# EAGLE design cascadio (EAGLE 9.5.0)

## Sheet 1 of 3
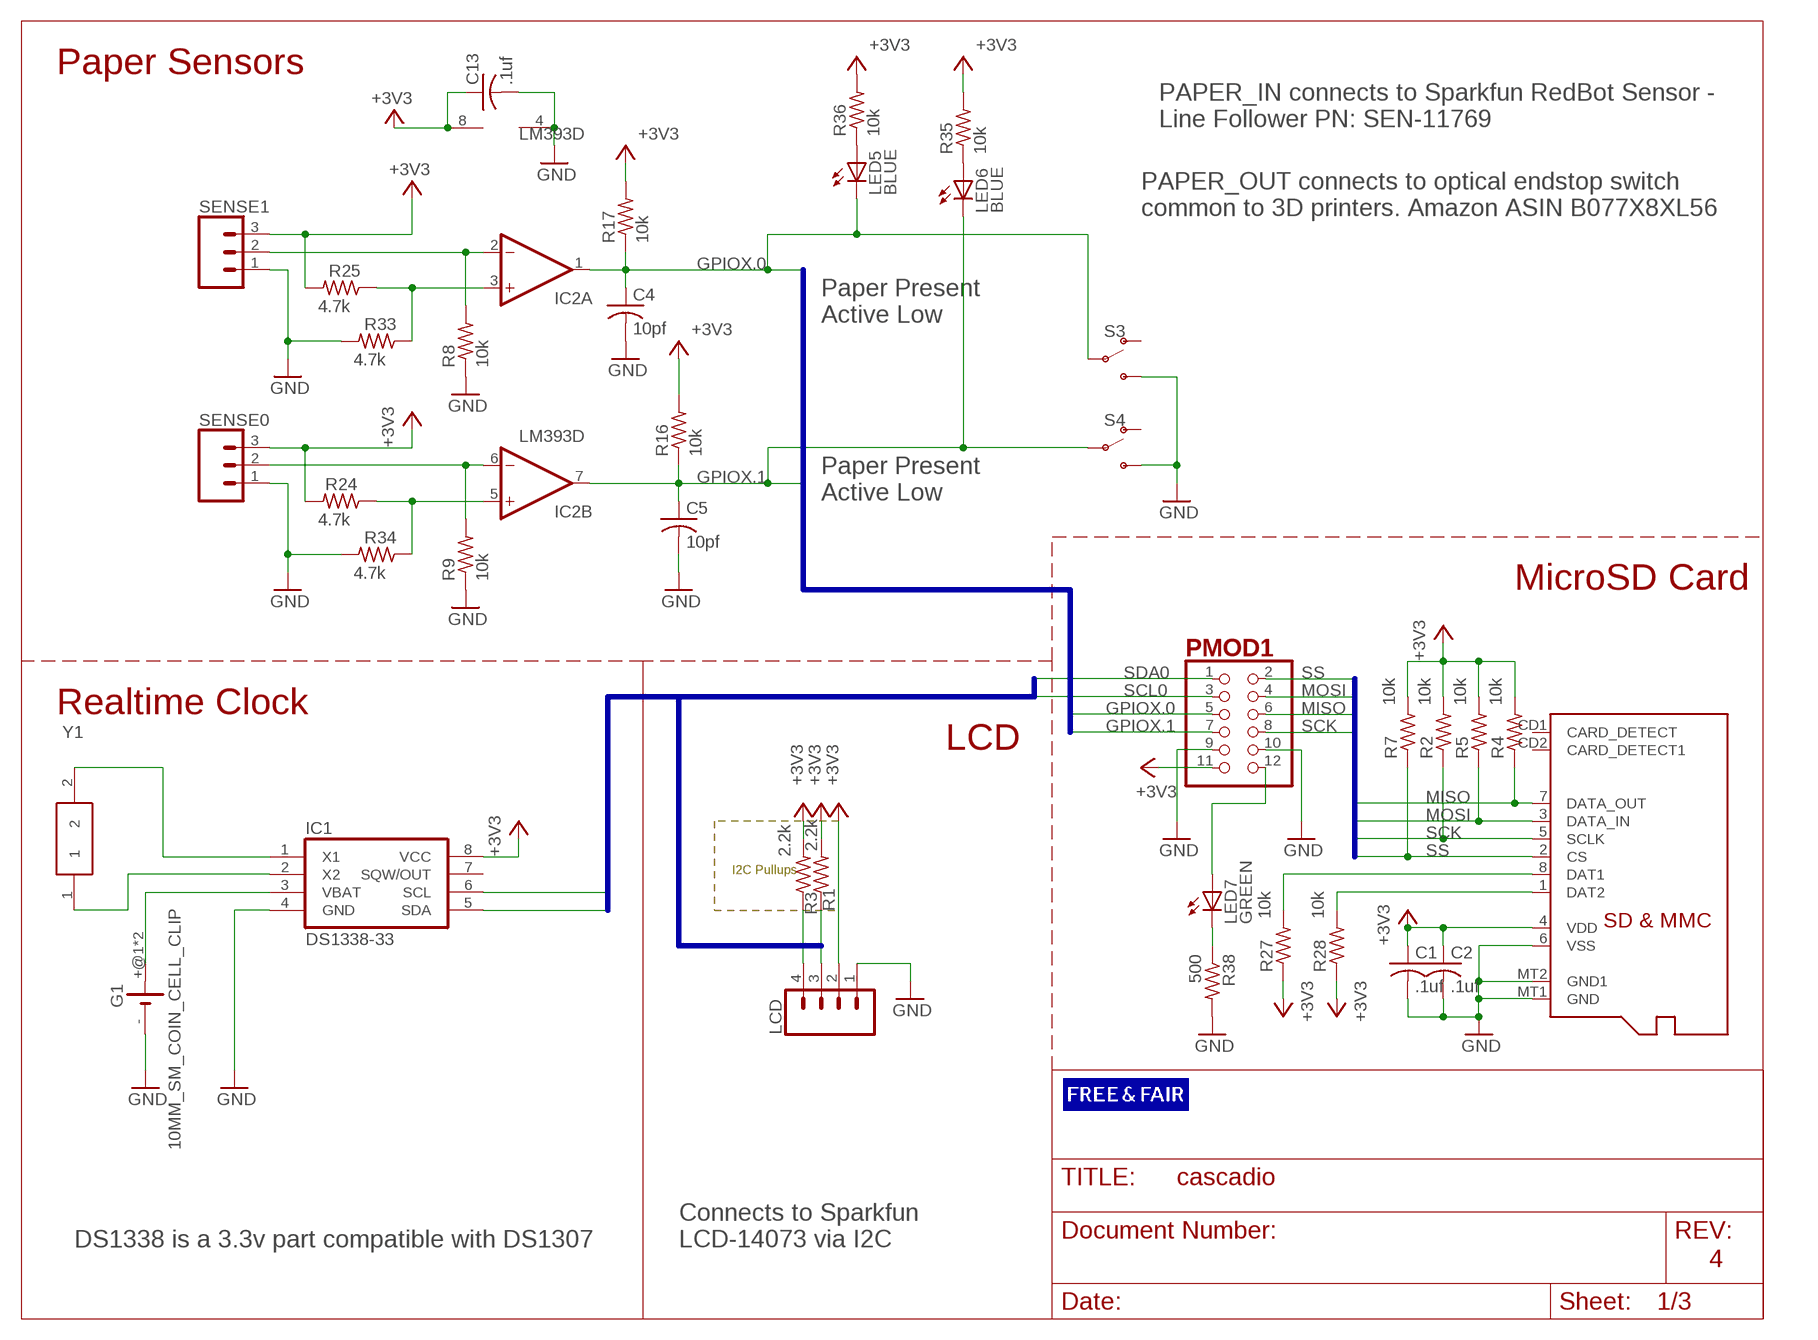
[diagram p0: schematic, sheet 1]

### Parts
C1  .1uf  C-USC0603K  [C0603K]
C2  .1uf  C-USC0603K  [C0603K]
C4  10pf  C-USC0603K  [C0603K]
C5  10pf  C-USC0603K  [C0603K]
C13  .1uf  C-USC0603K  [C0603K]
G1  10MM_SM_COIN_CELL_CLIP  [10MM_SM_COIN_CELL_CLIP]
IC1  DS1338-33  IC_RTC_DS1307  [SO-8]
IC2  LM393D  [SO08]
LCD  CONN_04POLAR_LOCK  [MOLEX-1X4_LOCK]
LED5  BLUE  LEDCHIP-LED0603  [CHIP-LED0603]
LED6  BLUE  LEDCHIP-LED0603  [CHIP-LED0603]
LED7  GREEN  LEDCHIP-LED0603  [CHIP-LED0603]
PMOD1  PINHD-2X6  [2X06]
R1  2.2k  R-US_R0603  [R0603]
R2  10k  R-US_R0603  [R0603]
R3  2.2k  R-US_R0603  [R0603]
R4  10k  R-US_R0603  [R0603]
R5  10k  R-US_R0603  [R0603]
R7  10k  R-US_R0603  [R0603]
R8  10k  R-US_R0603  [R0603]
R9  10k  R-US_R0603  [R0603]
R16  10k  R-US_R0603  [R0603]
R17  10k  R-US_R0603  [R0603]
R24  4.7k  R-US_R0603  [R0603]
R25  4.7k  R-US_R0603  [R0603]
R27  10k  R-US_R0603  [R0603]
R28  10k  R-US_R0603  [R0603]
R33  4.7k  R-US_R0603  [R0603]
R34  4.7k  R-US_R0603  [R0603]
R35  10k  R-US_R0603  [R0603]
R36  10k  R-US_R0603  [R0603]
R38  500  R-US_R0603  [R0603]
S3  SPDT_TOGGLE_BUTTONMICRO  [BTN-PUSH-PUSH-PS-2214-L]
S4  SPDT_TOGGLE_BUTTONMICRO  [BTN-PUSH-PUSH-PS-2214-L]
SENSE0  SENSE0  CONN_03POLAR_LOCK  [MOLEX-1X3_LOCK]
SENSE1  CONN_03POLAR_LOCK  [MOLEX-1X3_LOCK]
U1  MICROSD  [MICROSD]
Y1  32.768khz  ABS07W-32.768KHZ-D-1-T  [ABS07AIG32768KHZ71T]

### Nets
+3V3: C1.1 C2.1 C13.1 IC1.8(VCC) IC2.8(P:V+) LCD.2 PMOD1.11 R1.2 R2.2 R3.2 R4.2 R5.2 R7.2 R16.2 R17.2 R24.2 R25.2 R27.1 R28.1 R35.2 R36.2 SENSE0.3 SENSE1.3 U1.4(VDD) ; also sheet 2,3
GND: C1.2 C2.2 C4.2 C5.2 C13.2 G1.- IC1.4(GND) IC2.4(P:V-) LCD.1 PMOD1.9 PMOD1.10 R8.1 R9.1 R33.2 R34.2 R38.2 S3.NO0(S) S3.NO1(S) S4.NO0(S) S4.NO1(S) SENSE0.1 SENSE1.1 U1.6(VSS) U1.MT1(GND) U1.MT2(GND1) ; also sheet 2,3
GPIOX.0: C4.1 IC2.1(A:OUT) LED5.C PMOD1.5 R17.1 S3.C0(P) S3.C1(P) ; also sheet 3
GPIOX.1: C5.1 IC2.7(B:OUT) LED6.C PMOD1.7 R16.1 S4.C0(P) S4.C1(P) ; also sheet 3
MISO: PMOD1.6 R4.1 U1.7(DATA_OUT) ; also sheet 3
MOSI: PMOD1.4 R5.1 U1.3(DATA_IN) ; also sheet 3
N$1: IC2.5(B:+IN) R24.1 R34.1
N$2: IC2.3(A:+IN) R25.1 R33.1
N$3: IC1.1(X1) Y1.2
N$6: R27.2 U1.8(DAT1)
N$7: R28.2 U1.1(DAT2)
N$8: IC1.2(X2) Y1.1
N$9: G1.+@1(+) G1.+@2(+) IC1.3(VBAT)
N$13: IC2.2(A:-IN) R8.2 SENSE1.2
N$15: IC2.6(B:-IN) R9.2 SENSE0.2
N$18: LED6.A R35.1
N$19: LED5.A R36.1
N$22: LED7.C R38.1
N$23: LED7.A PMOD1.12
SCK: PMOD1.8 R2.1 U1.5(SCLK) ; also sheet 3
SCL0: IC1.6(SCL) LCD.4 PMOD1.3 R3.1 ; also sheet 3
SDA0: IC1.5(SDA) LCD.3 PMOD1.1 R1.1 ; also sheet 3
SS: PMOD1.2 R7.1 U1.2(CS) ; also sheet 3
Unconnected: IC1.7(SQW/OUT) S3.NC0(O) S3.NC1(O) S4.NC0(O) S4.NC1(O) U1.CD1(CARD_DETECT) U1.CD2(CARD_DETECT1)

### Buses
MISO,MOSI,SCK,SS
I2C:SCL0,SDA0
GPIOX.0,GPIOX.1

### Notes on the sheet
- Paper Sensors
- PAPER_IN connects to Sparkfun RedBot Sensor - 
  Line Follower PN: SEN-11769
- PAPER_OUT connects to optical endstop switch 
  common to 3D printers. Amazon ASIN B077X8XL56
- Paper Present
  Active Low
- Paper Present
  Active Low
- MicroSD Card
- Realtime Clock
- LCD
- I2C Pullups
- DS1338 is a 3.3v part compatible with DS1307
- Connects to Sparkfun
  LCD-14073 via I2C
- 4

## Sheet 2 of 3
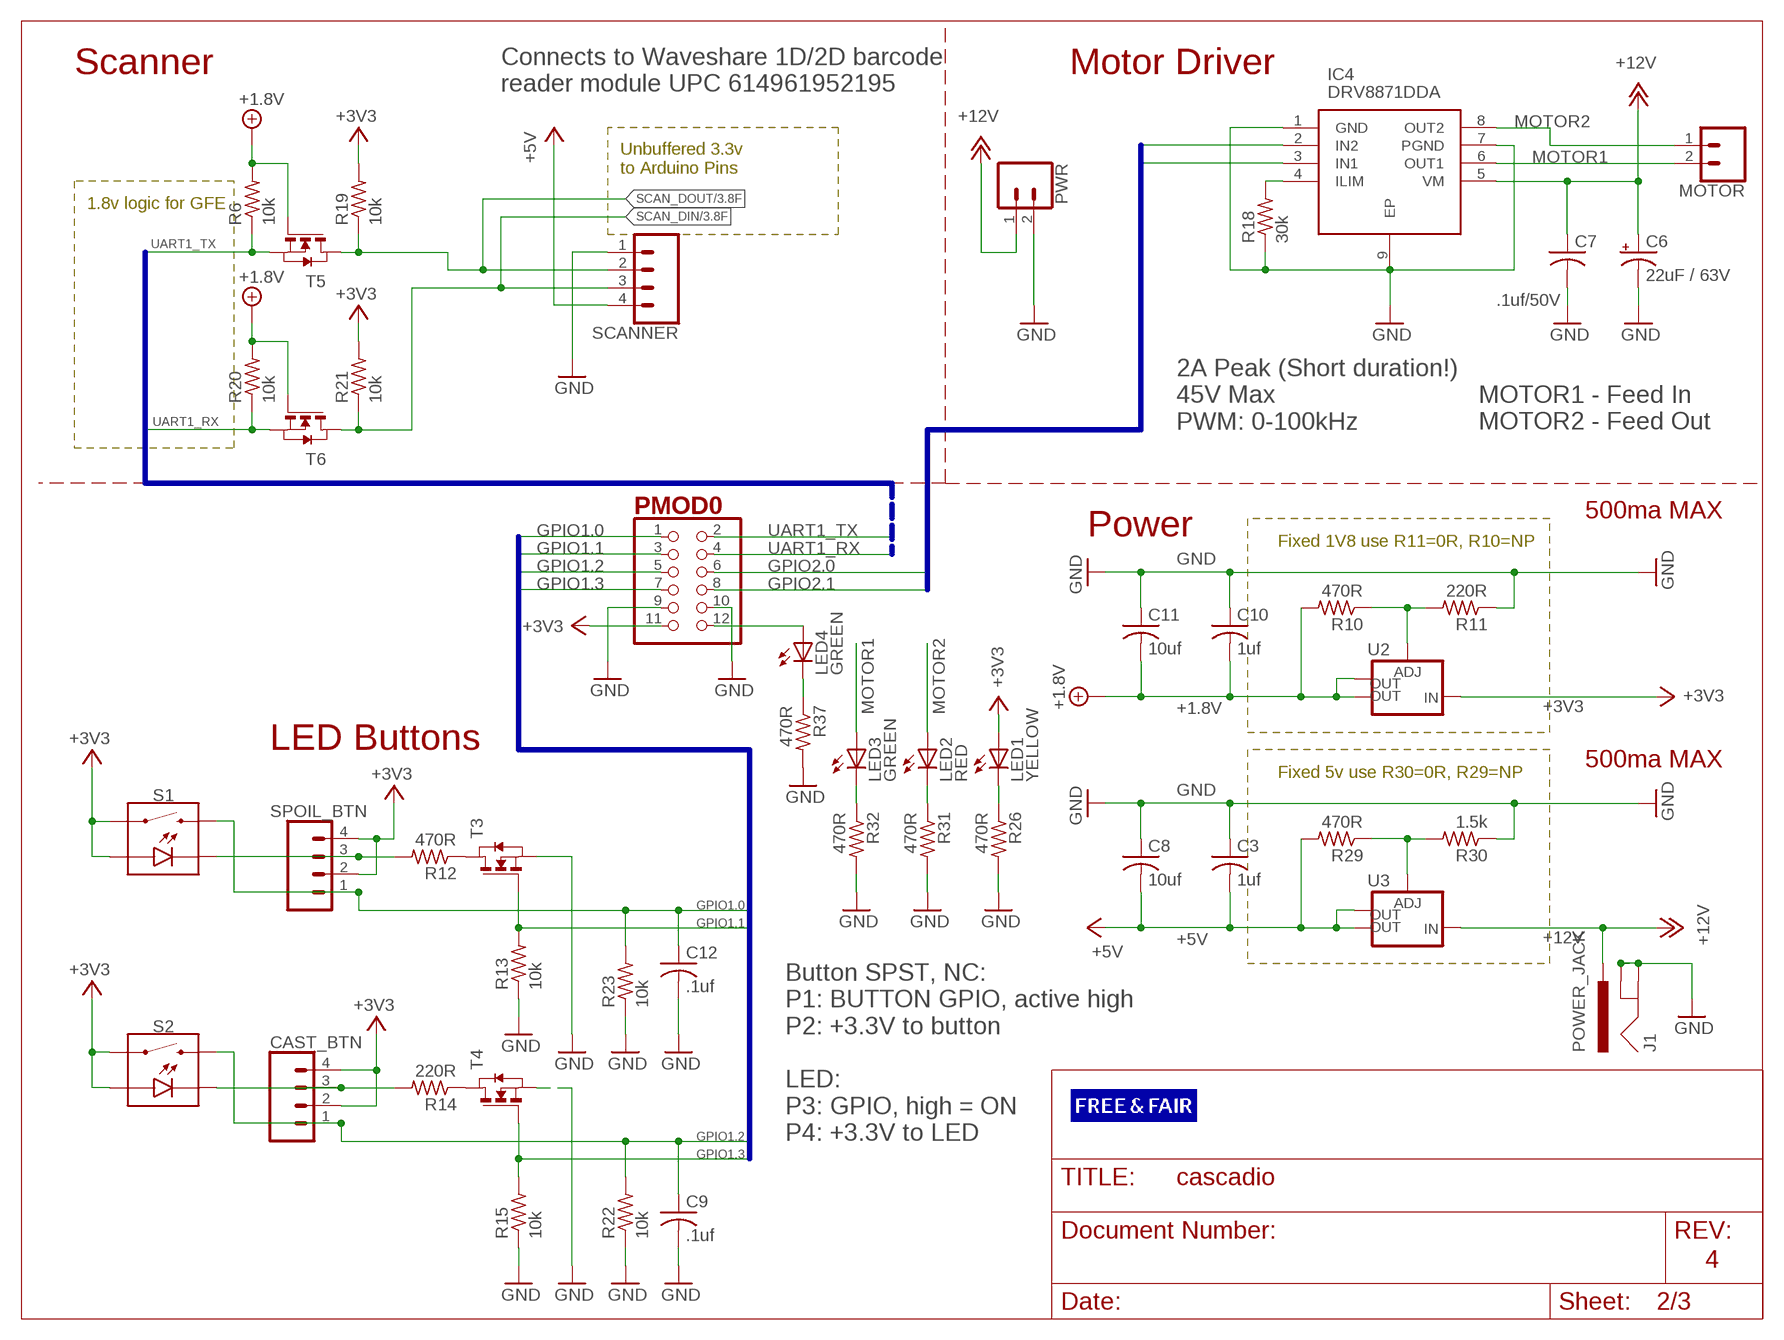
[diagram p1: schematic, sheet 2]

### Parts
C3  1uf  C-USC0603K  [C0603K]
C6  22uF / 63V  CPOL-USD  [PANASONIC_D]
C7  .1uf/50V  C-USC0805K  [C0805K]
C8  10uf  C-USC1206K  [C1206K]
C9  .1uf  C-USC0603K  [C0603K]
C10  1uf  C-USC0603K  [C0603K]
C11  10uf  C-USC1206K  [C1206K]
C12  .1uf  C-USC0603K  [C0603K]
CAST_BTN  CONN_04POLAR_LOCK  [MOLEX-1X4_LOCK]
IC4  DRV8871DDA  [SOIC127P600X170-9N]
J1  POWER_JACK  [POWER_JACK_PTH]
LED1  YELLOW  LEDCHIP-LED0603  [CHIP-LED0603]
LED2  RED  LEDCHIP-LED0603  [CHIP-LED0603]
LED3  GREEN  LEDCHIP-LED0603  [CHIP-LED0603]
LED4  GREEN  LEDCHIP-LED0603  [CHIP-LED0603]
MOTOR  CONN_02POLAR_LOCK  [MOLEX-1X2_LOCK]
PMOD0  PINHD-2X6  [2X06]
PWR  CONN_02POLAR_LOCK  [MOLEX-1X2_LOCK]
R6  10k  R-US_R0603  [R0603]
R10  470R  R-US_R0603  [R0603]
R11  220R  R-US_R0603  [R0603]
R12  470R  R-US_R0603  [R0603]
R13  10k  R-US_R0603  [R0603]
R14  220R  R-US_R0603  [R0603]
R15  10k  R-US_R0603  [R0603]
R18  30k  R-US_R0603  [R0603]
R19  10k  R-US_R0603  [R0603]
R20  10k  R-US_R0603  [R0603]
R21  10k  R-US_R0603  [R0603]
R22  10k  R-US_R0603  [R0603]
R23  10k  R-US_R0603  [R0603]
R26  470R  R-US_R0603  [R0603]
R29  470R  R-US_R0603  [R0603]
R30  1.5k  R-US_R0603  [R0603]
R31  470R  R-US_R0603  [R0603]
R32  470R  R-US_R0603  [R0603]
R37  470R  R-US_R0603  [R0603]
S1  MOMENTARY-SWITCH-SPST-LED-PTH-12MM  [TACTILE_SWITCH_LED_PTH_12MM]
S2  MOMENTARY-SWITCH-SPST-LED-PTH-12MM  [TACTILE_SWITCH_LED_PTH_12MM]
SCANNER  CONN_04POLAR_LOCK  [MOLEX-1X4_LOCK]
SPOIL_BTN  CONN_04POLAR_LOCK  [MOLEX-1X4_LOCK]
T3  PMV65UNEAR  NMOSSOT23  [SOT-23]
T4  PMV65UNEAR  NMOSSOT23  [SOT-23]
T5  PMV65UNEAR  NMOSSOT23  [SOT-23]
T6  PMV65UNEAR  NMOSSOT23  [SOT-23]
U2  V_REG_LM1117SOT223  [SOT223]
U3  V_REG_LM1117SOT223  [SOT223]

### Nets
+1.8V: C10.2 C11.2 R6.2 R10.2 R20.2 T5.3(G) T6.3(G) U2.2(OUT) U2.4(OUT)
+3V3: CAST_BTN.2 CAST_BTN.4 LED1.A PMOD0.11 R19.2 R21.2 S1.4 S1.A S2.4 S2.A SPOIL_BTN.2 SPOIL_BTN.4 U2.3(IN) ; also sheet 1,3
+5V: C3.2 C8.2 R29.2 SCANNER.4 U3.2(OUT) U3.4(OUT)
+12V: C6.+ C7.1 IC4.5(VM) J1.PWR PWR.1 U3.3(IN)
GND: C3.1 C6.- C7.2 C8.1 C9.2 C10.1 C11.1 C12.2 IC4.1(GND) IC4.7(PGND) IC4.9(EP) J1.GND J1.GNDBREAK PMOD0.9 PMOD0.10 PWR.2 R11.1 R13.1 R15.1 R18.1 R22.1 R23.1 R26.2 R30.1 R31.2 R32.2 R37.2 SCANNER.1 T3.2(S) T4.2(S) ; also sheet 1,3
GPIO1.0: C12.1 PMOD0.1 R23.2 S1.2 SPOIL_BTN.1 ; also sheet 3
GPIO1.1: PMOD0.3 R13.2 T3.3(G) ; also sheet 3
GPIO1.2: C9.1 CAST_BTN.1 PMOD0.5 R22.2 S2.2 ; also sheet 3
GPIO1.3: PMOD0.7 R15.2 T4.3(G) ; also sheet 3
GPIO2.0: IC4.2(IN2) PMOD0.6 ; also sheet 3
GPIO2.1: IC4.3(IN1) PMOD0.8 ; also sheet 3
MOTOR1: IC4.6(OUT1) LED3.A MOTOR.2
MOTOR2: IC4.8(OUT2) LED2.A MOTOR.1
N$4: LED1.C R26.1
N$10: R12.1 T3.1(D)
N$11: R29.1 R30.2 U3.1(ADJ)
N$12: R10.1 R11.2 U2.1(ADJ)
N$14: R12.2 S1.C SPOIL_BTN.3
N$16: LED2.C R31.1
N$17: LED3.C R32.1
N$20: LED4.A PMOD0.12
N$21: LED4.C R37.1
N$26: R14.1 T4.1(D)
N$29: IC4.4(ILIM) R18.2
N$30: CAST_BTN.3 R14.2 S2.C
SCAN_DIN: R21.1 SCANNER.3 T6.1(D) ; also sheet 3
SCAN_DOUT: R19.1 SCANNER.2 T5.1(D) ; also sheet 3
UART1_RX: PMOD0.4 R20.1 T6.2(S)
UART1_TX: PMOD0.2 R6.1 T5.2(S)

### Buses
UART1_RX,UART1_TX
GPIO2.0,GPIO2.1
GPIO1.0,UART1_TX,GND,GPIO2.0,UART1_RX,GPIO2.1,GPIO1.1,GPIO1.2,GPIO1.3

### Notes on the sheet
- Scanner | Motor Driver
- Connects to Waveshare 1D/2D barcode
  reader module UPC 614961952195
- Unbuffered 3.3v
  to Arduino Pins
- 1.8v logic for GFE
- 2A Peak (Short duration!)
  45V Max
  PWM: 0-100kHz
- MOTOR1 - Feed In
  MOTOR2 - Feed Out
- 500ma MAX
- Power
- Fixed 1V8 use R11=0R, R10=NP
- LED Buttons
- 500ma MAX
- Fixed 5v use R30=0R, R29=NP
- Button SPST, NC:
  P1: BUTTON GPIO, active high
  P2: +3.3V to button 
  
  LED:
  P3: GPIO, high = ON
  P4: +3.3V to LED
- 4

## Sheet 3 of 3
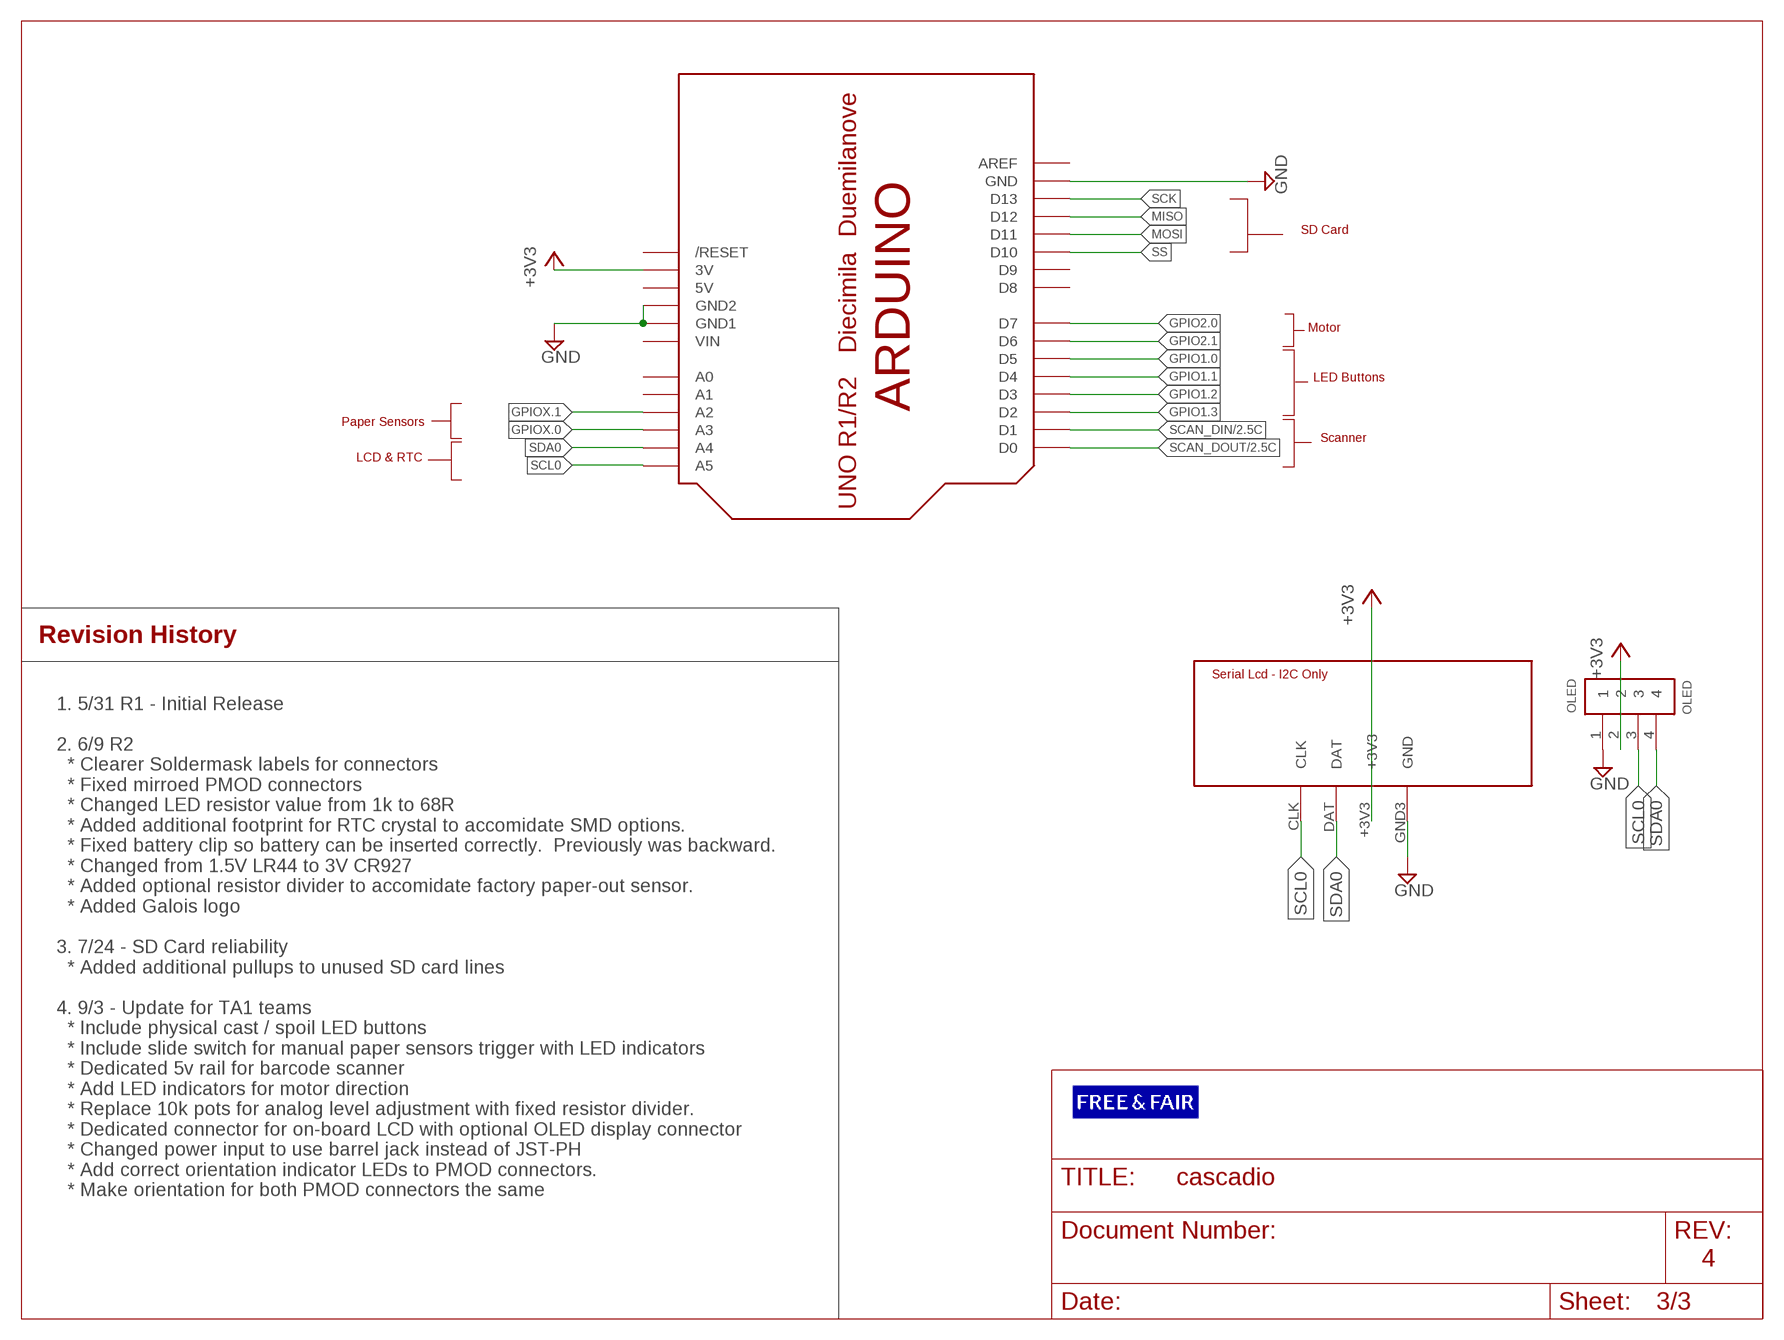
[diagram p2: schematic, sheet 3]

### Parts
OLED  OLED  1X4-CLEANBIG  [1X04-CLEANBIG]
U$1  SERLCD_I2C  [SERLCD]
U$2  ARDUINO-NOHOLE  [ARDUINO-NOHOLE]

### Nets
+3V3: OLED.2 U$1.+3V3 U$2.3V ; also sheet 1,2
GND: OLED.1 U$1.GND3(GND) U$2.GND U$2.GND1 U$2.GND2 ; also sheet 1,2
GPIO1.0: U$2.D5 ; also sheet 2
GPIO1.1: U$2.D4 ; also sheet 2
GPIO1.2: U$2.D3 ; also sheet 2
GPIO1.3: U$2.D2 ; also sheet 2
GPIO2.0: U$2.D7 ; also sheet 2
GPIO2.1: U$2.D6 ; also sheet 2
GPIOX.0: U$2.A3 ; also sheet 1
GPIOX.1: U$2.A2 ; also sheet 1
MISO: U$2.D12 ; also sheet 1
MOSI: U$2.D11 ; also sheet 1
SCAN_DIN: U$2.D1 ; also sheet 2
SCAN_DOUT: U$2.D0 ; also sheet 2
SCK: U$2.D13 ; also sheet 1
SCL0: OLED.3 U$1.CLK U$2.A5 ; also sheet 1
SDA0: OLED.4 U$1.DAT U$2.A4 ; also sheet 1
SS: U$2.D10 ; also sheet 1
Unconnected: U$2.A0 U$2.A1 U$2.AREF U$2.D8 U$2.D9 U$2.RESET(/RESET)

### Notes on the sheet
- SD Card
- Motor
- LED Buttons
- Paper Sensors
- Scanner
- LCD & RTC
- Revision History
- 1. 5/31 R1 - Initial Release
  
  2. 6/9 R2
    * Clearer Soldermask labels for connectors
    * Fixed mirroed PMOD connectors
    * Changed LED resistor value from 1k to 68R
    * Added additional footprint for RTC crystal to accomidate SMD options.
    * Fixed battery clip so battery can be inserted correctly.  Previously was backward.
    * Changed from 1.5V LR44 to 3V CR927
    * Added optional resistor divider to accomidate factory paper-out sensor.
    * Added Galois logo
  
  3. 7/24 - SD Card reliability
    * Added additional pullups to unused SD card lines
  
  4. 9/3 - Update for TA1 teams
    * Include physical cast / spoil LED buttons
    * Include slide switch for manual paper sensors trigger with LED indicators
    * Dedicated 5v rail for barcode scanner
    * Add LED indicators for motor direction
    * Replace 10k pots for analog level adjustment with fixed resistor divider.
    * Dedicated connector for on-board LCD with optional OLED display connector
    * Changed power input to use barrel jack instead of JST-PH
    * Add correct orientation indicator LEDs to PMOD connectors.
    * Make orientation for both PMOD connectors the same
- 4

## Power pins joined to a net without a drawn wire
5V: U$2.5V
VIN: U$2.VIN

## Library data of the parts
C1 C2 C4 C5 C7 C13 = adafruit:C-US: CAPACITOR, American symbol
C3 C9 C10 C12 = rcl:C-US: CAPACITOR, American symbol; SPICEPREFIX: C
C6 = adafruit:CPOL-US: POLARIZED CAPACITOR, American symbol
C8 C11 = resistor:C-US: CAPACITOR, American symbol
CAST_BTN LCD SCANNER SPOIL_BTN = SparkFun-Connectors:CONN_04: Multi connection point. Often used as Generic Header-pin footprint for 0.1 inch spaced/style header connections On any of the 0.1 inch spaced packages, you can populate with these: Break Away Headers - Straight <https://www.sparkfun.com/products/116> (PRT-00116) Break Away Male Headers - Right Angle <https://www.sparkfun.com/products/553> (PRT-00553) Female Headers <https://www.sparkfun.com/products/115> (PRT-00115) Break Away Headers - Machine Pin <https://www.sparkfun.com/products/117> (PRT-00117) Break Away Female Headers - Swiss Machine Pin <https://www.sparkfun.com/products/743> (PRT-00743) For SCREWTERMINALS and SPRING TERMINALS visit here: Screw Terimnals on SparkFun.com <https://www.sparkfun.com/search/results?term=Screw+Terminals> (5mm/3.5mm/2.54mm spacing) This device is also useful as a general connection point to wire up your design to another part of your project. Our various solder wires solder well into these plated through hole pads. Hook-Up Wire - Assortment (Stranded, 22 AWG) <https://www.sparkfun.com/products/11375> (PRT-11375) Hook-Up Wire - Assortment (Solid Core, 22 AWG) <https://www.sparkfun.com/products/11367> (PRT-11367) View the entire wire category on our website here <https://www.sparkfun.com/categories/141> Special notes: Molex polarized connector foot print use with SKU : PRT-08231 with associated crimp pins and housings. 1MM SMD Version SKU: PRT-10208; PROD_ID: CONN-08186; SF_ID: PRT-08231
G1 = battery:10MM_SM_COIN_CELL_CLIP: Battery cell clip for CR927 Source: KEYSTONE ELECTRONICS CORP. www.keyelco.com, ASTORIA, N.Y. 11105-2017 PART ANME 10mm SM COIN CELl CLIP DWG NO. 3030
IC1 = dp_devices:IC_RTC_DS1307
IC2 = linear:LM393: COMPARATOR
IC4 = SamacSys_Parts:DRV8871DDA: Motor / Motion / Ignition Controllers & Drivers 3.6A Brushed DC Motor Driver with Integrated Current Sensing (PWM Ctrl) 8-SO PowerPAD -40 to 125 Source: Datasheet <http://www.ti.com/lit/ds/symlink/drv8871.pdf>; DESCRIPTION: Motor / Motion / Ignition Controllers & Drivers 3.6A Brushed DC Motor Driver with Integrated Current Sensing (PWM Ctrl) 8-SO PowerPAD -40 to 125; HEIGHT: 1.7mm; MANUFACTURER_NAME: Texas Instruments; MANUFACTURER_PART_NUMBER: DRV8871DDA; MOUSER_PART_NUMBER: 595-DRV8871DDA; MOUSER_PRICE-STOCK: https://www.mouser.com/Search/Refine.aspx?Keyword=595-DRV8871DDA
J1 = SparkFun-Connectors:POWER_JACK: Power Jack Connector This is the standard 5.5mm barrel jack for power. The PTH is the most common, proven, reliable, footprint. The Slot footprint only works if the mill layer is transmitted to the PCB fab house so be warned. Here are the connectors we sell at SparkFun: DC Barrel Power Jack/Connector <https://www.sparkfun.com/products/119> (PRT-00119) DC Barrel Power Jack/Connector (SMD) <https://www.sparkfun.com/products/12748> (PRT-12748) DC Barrel Jack Adapter - Breadboard Compatible <https://www.sparkfun.com/products/10811> (PRT-10811) It is used on this SparkFun product (and many, many others): SparkFun RedBoard - Programmed with Arduino <https://www.sparkfun.com/products/12757> (DEV-12757) Also, if you need a mating power supply or connector, please check these out: Wall Adapter Power Supply - 9VDC 650mA <https://www.sparkfun.com/products/298> (TOL-00298) DC Barrel Jack Adapter - Male <https://www.sparkfun.com/products/10287> (PRT-10287); PROD_ID: CONN-08197
LED1-LED7 = adafruit:LED: LED OSRAM: - CHIPLED LG R971, LG N971, LY N971, LG Q971, LY Q971, LO R971, LY R971 LH N974, LH R974 LS Q976, LO Q976, LY Q976 LO Q996 - Hyper CHIPLED LW Q18S LB Q993, LB Q99A, LB R99A - SideLED LS A670, LO A670, LY A670, LG A670, LP A670 LB A673, LV A673, LT A673, LW A673 LH A674 LY A675 LS A676, LA A676, LO A676, LY A676, LW A676 LS A679, LY A679, LG A679 - Hyper Micro SIDELED® LS Y876, LA Y876, LO Y876, LY Y876 LT Y87S - SmartLED LW L88C, LW L88S LB L89C, LB L89S, LG L890 LS L89K, LO L89K, LY L89K LS L896, LA L896, LO L896, LY L896 - TOPLED LS T670, LO T670, LY T670, LG T670, LP T670 LSG T670, LSP T670, LSY T670, LOP T670, LYG T670 LG T671, LOG T671, LSG T671 LB T673, LV T673, LT T673, LW T673 LH T674 LS T676, LA T676, LO T676, LY T676, LB T676, LH T676, LSB T676, LW T676 LB T67C, LV T67C, LT T67C, LS T67K, LO T67K, LY T67K, LW E67C LS E67B, LA E67B, LO E67B, LY E67B, LB E67C, LV E67C, LT E67C LW T67C LS T679, LY T679, LG T679 LS T770, LO T770, LY T770, LG T770, LP T770 LB T773, LV T773, LT T773, LW T773 LH T774 LS E675, LA E675, LY E675, LS T675 LS T776, LA T776, LO T776, LY T776, LB T776 LHGB T686 LT T68C, LB T68C - Hyper Mini TOPLED® LB M676 - Mini TOPLED Santana® LG M470 LS M47K, LO M47K, LY M47K Source: http://www.osram.convergy.de/
MOTOR PWR = SparkFun-Connectors:CONN_02: Multi connection point. Often used as Generic Header-pin footprint for 0.1 inch spaced/style header connections On any of the 0.1 inch spaced packages, you can populate with these: Break Away Headers - Straight <https://www.sparkfun.com/products/116> (PRT-00116) Break Away Male Headers - Right Angle <https://www.sparkfun.com/products/553> (PRT-00553) Female Headers <https://www.sparkfun.com/products/115> (PRT-00115) Break Away Headers - Machine Pin <https://www.sparkfun.com/products/117> (PRT-00117) Break Away Female Headers - Swiss Machine Pin <https://www.sparkfun.com/products/743> (PRT-00743) For SCREWTERMINALS and SPRING TERMINALS visit here: Screw Terimnals on SparkFun.com <https://www.sparkfun.com/search/results?term=Screw+Terminals> (5mm/3.5mm/2.54mm spacing) This device is also useful as a general connection point to wire up your design to another part of your project. Our various solder wires solder well into these plated through hole pads. Hook-Up Wire - Assortment (Stranded, 22 AWG) <https://www.sparkfun.com/products/11375> (PRT-11375) Hook-Up Wire - Assortment (Solid Core, 22 AWG) <https://www.sparkfun.com/products/11367> (PRT-11367) View the entire wire category on our website here <https://www.sparkfun.com/categories/141> Special notes: Molex polarized connector foot print use with: PRT-08233 with associated crimp pins and housings. 2.54_SCREWTERM for use with PRT-10571. 3.5mm Screw Terminal footprints for PRT-08084 5mm Screw Terminal footprints for use with PRT-08432; SF_ID: PRT-09918
OLED = adafruit:1X4: 4-pin connector
PMOD0 PMOD1 = pinhead:PINHD-2X6: PIN HEADER
R1-R9 R12-R25 R27 R28 R33-R36 = adafruit:R-US_: RESISTOR, American symbol
R10 R11 R26 R29-R32 R37 R38 = resistor:R-US_: RESISTOR, American symbol
S1 S2 = SparkFun-Switches:MOMENTARY-SWITCH-SPST-LED: Momentary Switch (Pushbutton) - SPST - w/ LED Normally-open (NO) SPST momentary switches (buttons, pushbuttons), with a built-in LED. Variants PTH-CHERRY - Cherry MX Switch Cherry MX Keyswitches are top-of-the-line mechanical keyboard switches. They’re satisfyingly “clicky”, reliable up to tens-of-millions of key presses, and a standard in gaming and programming keyboards across the globe. This ‘blue’ version Cherry MX Switch is favored by most due to its secondary internal actuator making it less likely to “double-tap.” If you are looking for a noticeably audible and high-quality key switch, this is the perfect option for you! Cherry MX Switch <https://www.sparkfun.com/products/13834> (COM-13834) Cherry MX Switch Breakout <https://www.sparkfun.com/products/13773> (BOB-13773) PTH-12MM and PTH-12MM-KIT - 12mm Illuminated LED KIT variant is for soldering kits. There is no tStop (covering up the top side of the pads with mask). This helps the beginner see which side they should be soldering too. LED Tactile Button Breakout <https://www.sparkfun.com/products/10467> (BOB-10467) LED Tactile Button - Red <https://www.sparkfun.com/products/10442> (COM-10442) LED Tactile Button - Blue <https://www.sparkfun.com/products/10443> (COM-10443) LED Tactile Button - Green <https://www.sparkfun.com/products/10440> (COM-10440) LED Tactile Button - Orange <https://www.sparkfun.com/products/10441> (COM-10441) LED Tactile Button - White <https://www.sparkfun.com/products/10439> (COM-10439); PROD_ID: SWCH-11758; SF_SKU: COM-10442
S3 S4 = bitsetters:SPDT_TOGGLE_BUTTON
SENSE0 SENSE1 = SparkFun-Connectors:CONN_03: Multi connection point. Often used as Generic Header-pin footprint for 0.1 inch spaced/style header connections On any of the 0.1 inch spaced packages, you can populate with these: Break Away Headers - Straight <https://www.sparkfun.com/products/116> (PRT-00116) Break Away Male Headers - Right Angle <https://www.sparkfun.com/products/553> (PRT-00553) Female Headers <https://www.sparkfun.com/products/115> (PRT-00115) Break Away Headers - Machine Pin <https://www.sparkfun.com/products/117> (PRT-00117) Break Away Female Headers - Swiss Machine Pin <https://www.sparkfun.com/products/743> (PRT-00743) Stackable Header - 3 Pin (Female, 0.1") <https://www.sparkfun.com/products/13875> (PRT-13875) For SCREWTERMINALS and SPRING TERMINALS visit here: Screw Terimnals on SparkFun.com <https://www.sparkfun.com/search/results?term=Screw+Terminals> (5mm/3.5mm/2.54mm spacing) This device is also useful as a general connection point to wire up your design to another part of your project. Our various solder wires solder well into these plated through hole pads. Hook-Up Wire - Assortment (Stranded, 22 AWG) <https://www.sparkfun.com/products/11375> (PRT-11375) Hook-Up Wire - Assortment (Solid Core, 22 AWG) <https://www.sparkfun.com/products/11367> (PRT-11367) View the entire wire category on our website here <https://www.sparkfun.com/categories/141> Special notes: Molex polarized connector foot print use with SKU : PRT-08232 with associated crimp pins and housings.; PROD_ID: CONN-08625; SF_ID: PRT-08096
T3-T6 = zetex:NMOSSOT23: MOS FET; OC_FARNELL: unknown; OC_NEWARK: unknown
U1 = adafruit:MICROSD: Micro-SD / Transflash card holder with SPI pinout For the 3M # 2908-05WB-MG and/or 4UCON #19656 push-push type
U2 U3 = SparkFun-IC-Power:V_REG_LM1117: Voltage Regulator LM1117 Standard adjustable voltage regulator but in SMD form. Spark Fun Electronics SKU : COM-00595; PROD_ID: VREG-08170
U$1 = bitsetters:SERLCD_I2C
U$2 = adafruit:ARDUINO: Arduino Diecimila/Duemilanove Make a shield with ease, this package has all the named pins as well as the two mounting drill holes and an outline of the USB and DC power connector. The outline is on the DIMENSION layer, so if your board house uses it they will cut the outline to match. http://www.ladyada.net/library/pcb/eaglelibrary.html
Y1 = SamacSys_Parts:ABS07W-32.768KHZ-D-1-T: Abracon 32.768kHz Crystal 2-SMD, No Lead 3.2 x1.5 x 0.9mm Source: Datasheet <https://componentsearchengine.com/Datasheets/1/ABS07W-32.768kHz-D-1-T.pdf>; DESCRIPTION: Abracon 32.768kHz Crystal 2-SMD, No Lead 3.2 x1.5 x 0.9mm; HEIGHT: 0mm; MANUFACTURER_NAME: ABRACON; MANUFACTURER_PART_NUMBER: ABS07W-32.768kHz-D-1-T; MOUSER_PART_NUMBER: 815-ABS07W32.768KD1T; MOUSER_PRICE-STOCK: https://www.mouser.com/Search/Refine.aspx?Keyword=815-ABS07W32.768KD1T

## Board
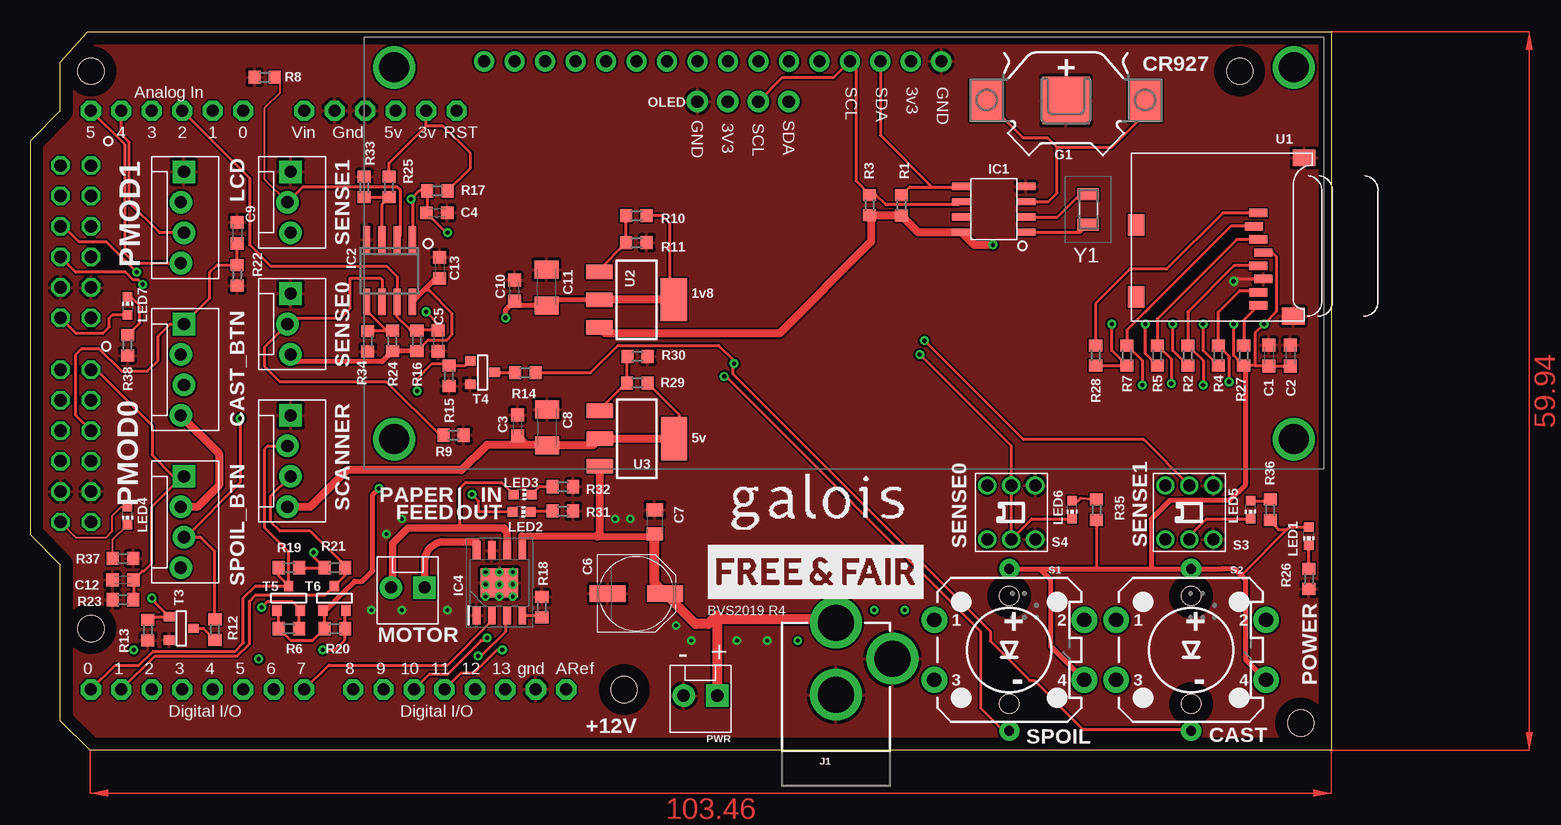
[diagram p3: board, top side]
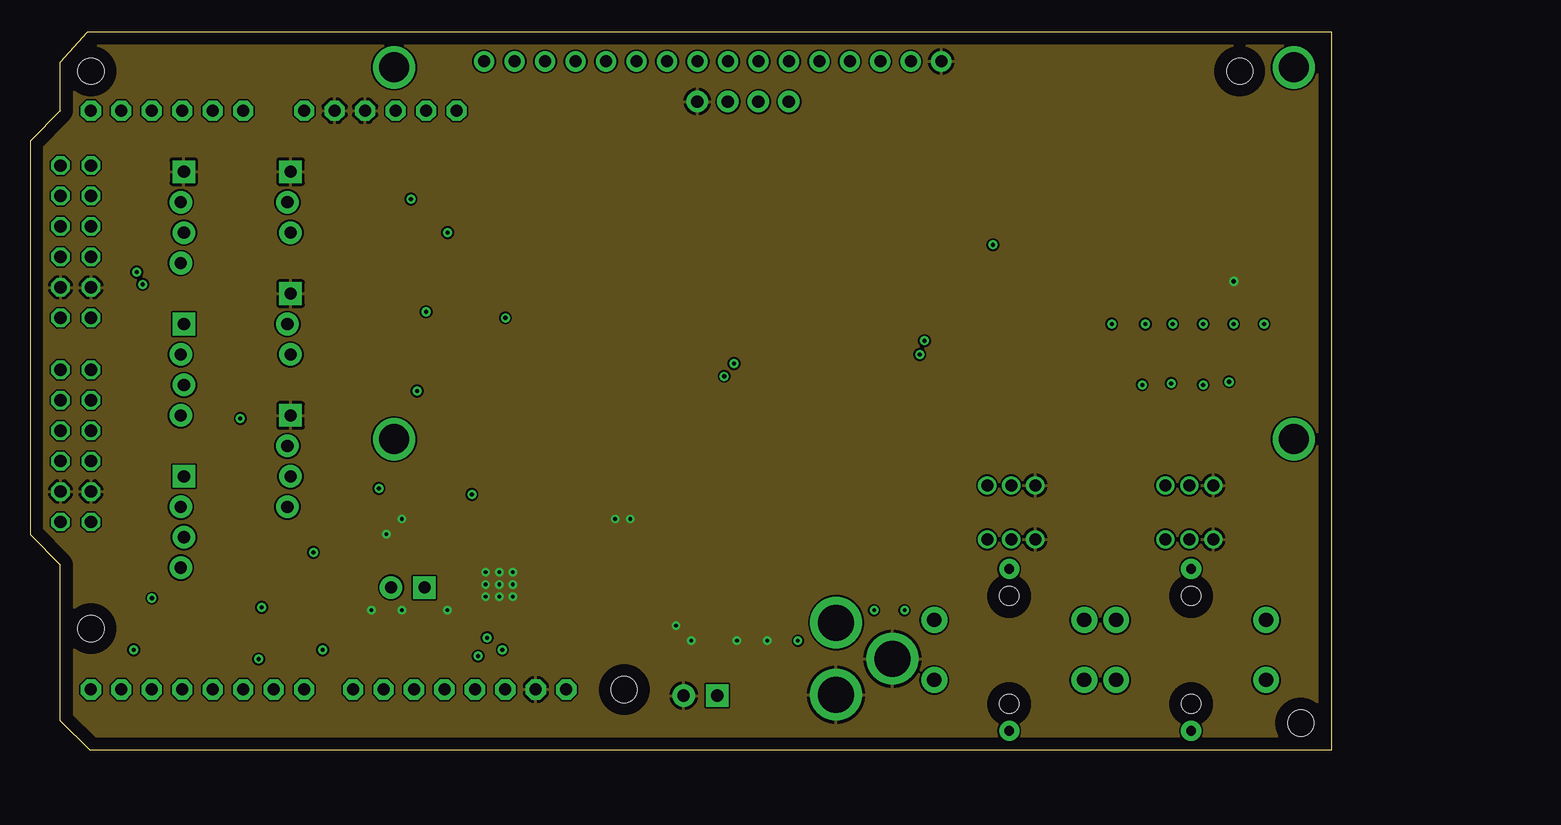
[diagram p4: board, inner layer Route2]
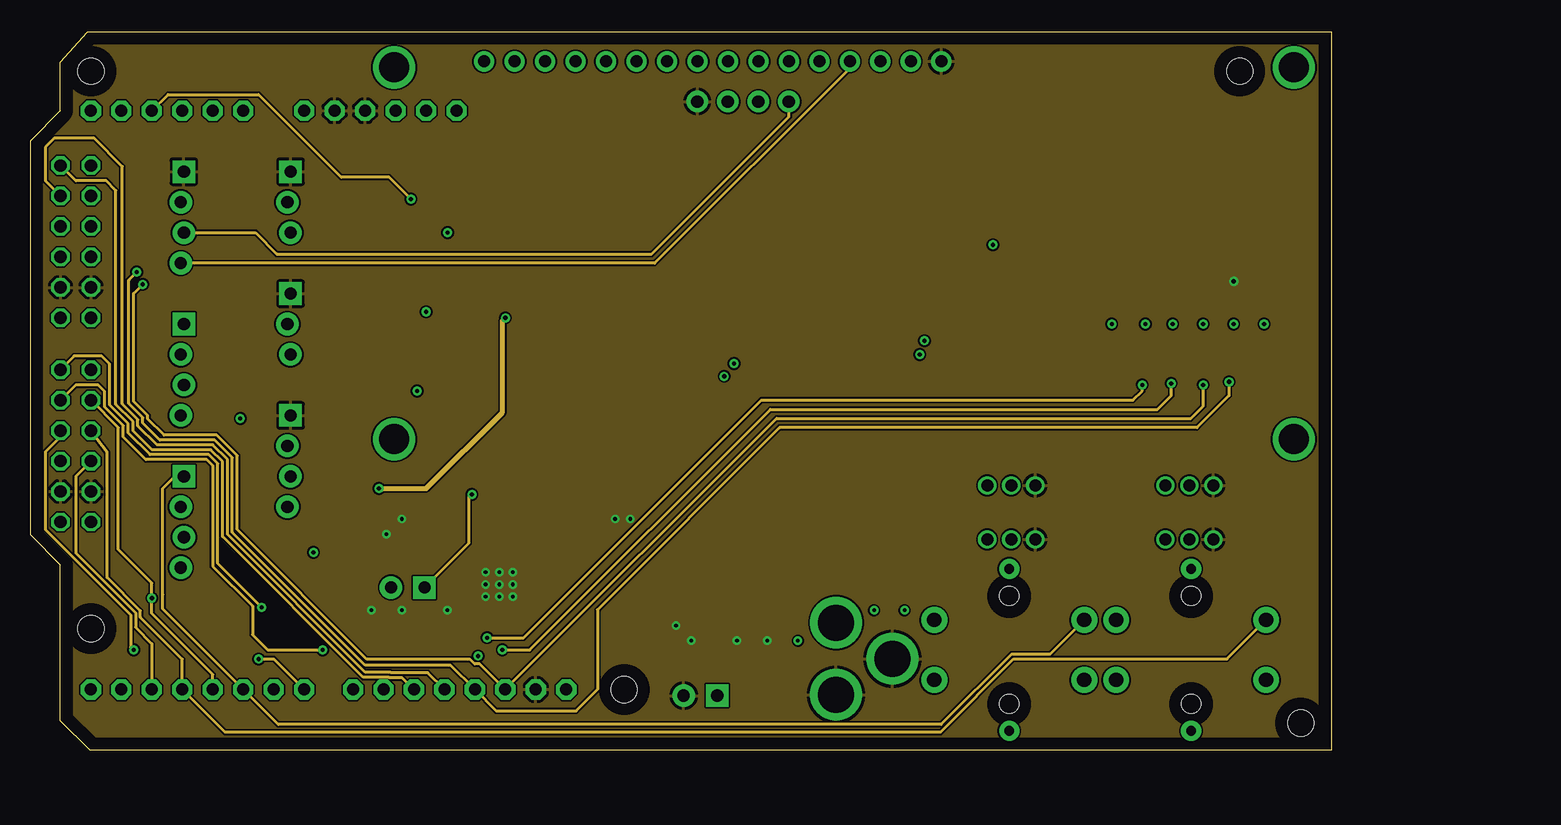
[diagram p5: board, inner layer Route15]
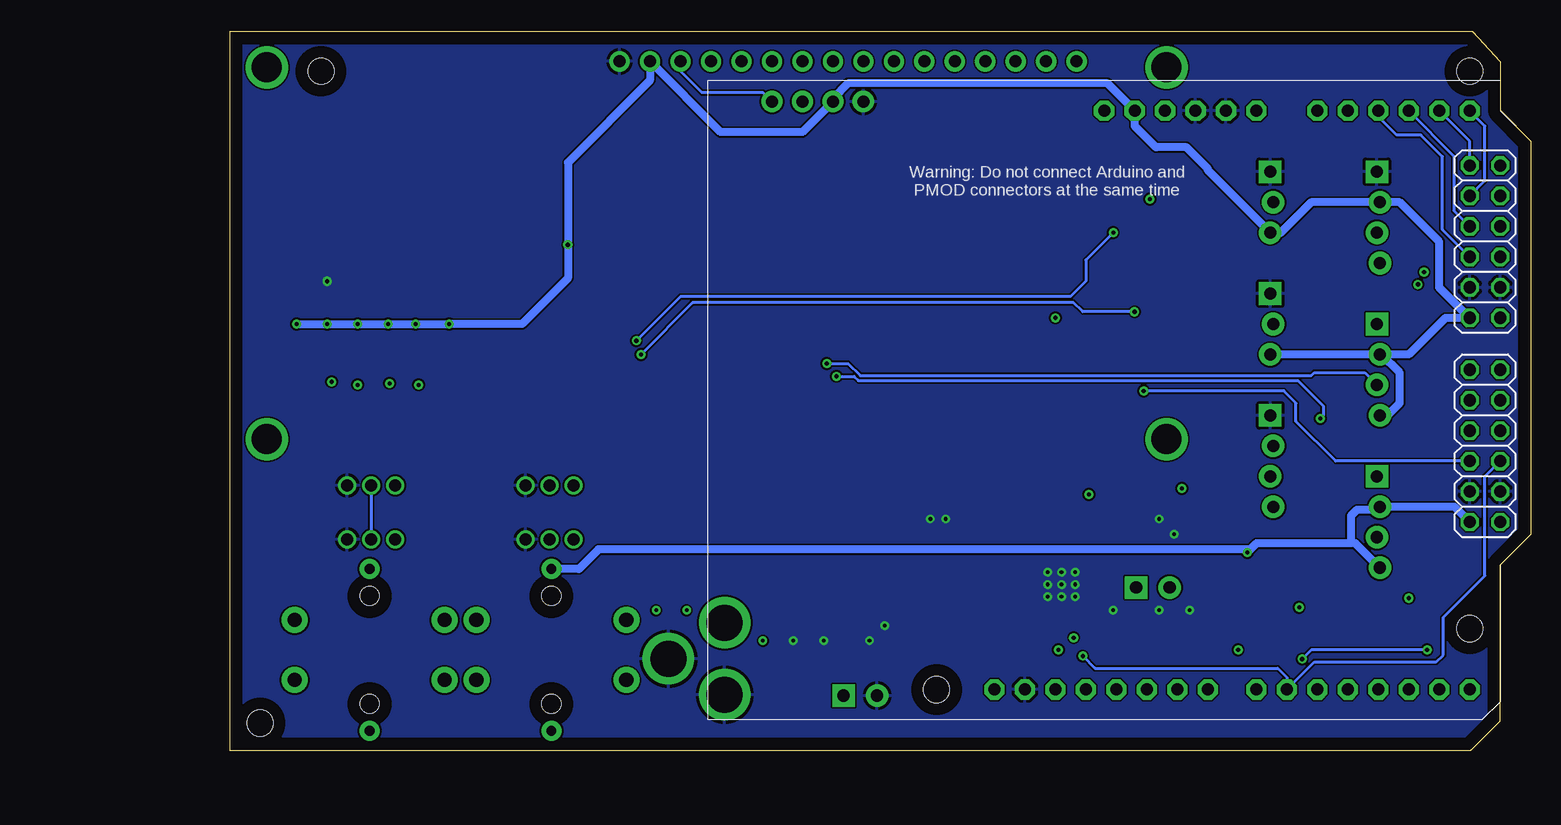
[diagram p6: board, bottom side, seen from below]

Size 108.46 x 59.94 mm. Coordinates in mm from the lower left corner, seen from the top.
Outline: 2.52,53.34 0,50.8 0,18.03 2.54,15.49 2.54,2.46 5.01,0 108.46,0 108.46,59.94 4.83,59.94 2.52,57.4 2.52,53.34
Copper layers (1+2*15+16): Top 0.035mm / dielectric 0.15mm / Route2 0.035mm / dielectric 0.15mm / Route15 0.035mm / dielectric 0.2mm / Bottom 0.035mm
Design rules "default *": minimum track width 6mil, minimum drill 0.3mm, track to track 6mil, track to pad 6mil, pad to pad 6mil, via to via 6mil, smd to smd 6mil, copper to edge 40mil, drill to drill 6mil, minimum pad ring 10mil, minimum via ring 8mil, stop-mask expansion 4mil, vias tented up to drill 15mil, thermal gap 10mil
Holes 2.16 mm at 5.09,10.15 49.53,5.07 5.09,56.64 105.92,2.28 100.84,56.64

### Footprints (pad centres in the part's own frame; a part is rotated, then mirrored left to right if it is on the bottom)
C0603K = smd 1.05 x 1.08: 1 -0.875,0; 2 0.875,0
PANASONIC_D = smd 3 x 1.4: + 2.4,0; - -2.4,0
C0805K = smd 1.1 x 1.4: 1 -1,0; 2 1,0
C1206K = smd 1.5 x 2: 1 -1.5,0; 2 1.5,0
MOLEX-1X4_LOCK = drill 1.016 pad 1.88 square: 1 0,0.127 | drill 1.016 pad 1.88: 2 2.54,-0.127; 3 5.08,0.127; 4 7.62,-0.127
10MM_SM_COIN_CELL_CLIP = smd 2.9 x 3.5: +@1 -6.6,0; +@2 6.6,0 | smd 3.96 x 3.96: - 0,0
SO-8 = smd 0.6 x 1.55: 1 -1.905,-2.69; 2 -0.635,-2.69; 3 0.635,-2.69; 4 1.905,-2.69; 5 1.905,2.71; 6 0.635,2.71; 7 -0.635,2.71; 8 -1.905,2.71
SO08 = smd 0.6 x 2.2: 1 -1.905,-2.6; 2 -0.635,-2.6; 3 0.635,-2.6; 4 1.905,-2.6; 5 1.905,2.6; 6 0.635,2.6; 7 -0.635,2.6; 8 -1.905,2.6
SOIC127P600X170-9N = smd 1.525 x 0.65: 1 -2.712,1.905; 2 -2.712,0.635; 3 -2.712,-0.635; 4 -2.712,-1.905; 5 2.712,-1.905; 6 2.712,-0.635; 7 2.712,0.635; 8 2.712,1.905 | smd 2.4 x 3.1: 9 0,0
POWER_JACK_PTH = drill 2.997 pad 4.318: GND 0,7.7; GNDBREAK 4.7,10.7; PWR 0,13.7
CHIP-LED0603 = smd 0.8 x 0.8: A 0,-0.75; C 0,0.75
MOLEX-1X2_LOCK = drill 1.016 pad 1.88 square: 1 -0.127,0 | drill 1.016 pad 1.88: 2 2.667,0
1X04-CLEANBIG = drill 1.016 pad 1.778: 1 -3.81,0; 2 -1.27,0; 3 1.27,0; 4 3.81,0
2X06 = drill 1.016 octagon: 1 -6.35,-1.27; 2 -6.35,1.27; 3 -3.81,-1.27; 4 -3.81,1.27; 5 -1.27,-1.27; 6 -1.27,1.27; 7 1.27,-1.27; 8 1.27,1.27; 9 3.81,-1.27; 10 3.81,1.27; 11 6.35,-1.27; 12 6.35,1.27
R0603 = smd 1 x 1.1: 1 -0.85,0; 2 0.85,0
TACTILE_SWITCH_LED_PTH_12MM = drill 1.2 pad 2.159: 1 -6.25,2.5; 2 6.25,2.5; 3 -6.25,-2.5; 4 6.25,-2.5 | drill 0.8 pad 1.676: A 0,6.75; C 0,-6.75 | hole 1.6: 0,4.5; 0,-4.5
BTN-PUSH-PUSH-PS-2214-L = drill 1: C0 0,0; C1 0,-4.5; NC0 -2,0; NC1 -2,-4.5; NO0 2,0; NO1 2,-4.5
MOLEX-1X3_LOCK = drill 1.016 pad 1.88 square: 1 0,0.127 | drill 1.016 pad 1.88: 2 2.54,-0.127; 3 5.08,0.127
SOT-23 = smd 0.787 x 0.889: 1 0.025,-1.016; 2 -0.94,1.016; 3 0.991,1.016
MICROSD = smd 0.7 x 1.5: 1 9,-10.64; 2 7.9,-10.24; 3 6.8,-10.64; 4 5.7,-11.04; 5 4.6,-10.64; 6 3.5,-11.04; 7 2.4,-10.64; 8 1.3,-10.64 | smd 1.8 x 1.4: CD1 2,-0.44; CD2 8,-0.44 | smd 1.4 x 1.9: MT1 0.4,-13.54; MT2 13.6,-14.44
SOT223 = smd 1.219 x 2.235: 1 -2.311,-3.099; 2 0,-3.099; 3 2.311,-3.099 | smd 3.6 x 2.2: 4 0,3.099
SERLCD = drill 1 pad 1.676: +3V3 45.56,34; CLK 40.48,34; DAT 43.02,34; GND0 10,34; GND2 12.54,34; GND3 48.1,34; P$1 15.08,34; P$2 17.62,34; P$3 20.16,34; P$4 22.7,34; P$5 25.24,34; P$6 27.78,34; P$7 30.32,34; P$8 32.86,34; P$9 35.4,34; P$10 37.94,34 | drill 2.5: P$17 2.5,2.5; P$18 77.5,2.5; P$19 2.5,33.5; P$20 77.5,33.5
ARDUINO-NOHOLE = drill 1 pad 1.676 octagon: 3V 35.56,2.54; 5V 38.1,2.54; A0 50.8,2.54; A1 53.34,2.54; A2 55.88,2.54; A3 58.42,2.54; A4 60.96,2.54; A5 63.5,2.54; AREF 23.876,50.8; D0 63.5,50.8; D1 60.96,50.8; D2 58.42,50.8; D3 55.88,50.8; D4 53.34,50.8; D5 50.8,50.8; D6 48.26,50.8; D7 45.72,50.8; D8 41.656,50.8; D9 39.116,50.8; D10 36.576,50.8; D11 34.036,50.8; D12 31.496,50.8; D13 28.956,50.8; GND 26.416,50.8; GND1 43.18,2.54; GND2 40.64,2.54; RESET 33.02,2.54; VIN 45.72,2.54
ABS07AIG32768KHZ71T = smd 1 x 1.8: 1 -1.275,0; 2 1.275,0

### Placement (x,y rotation side)
C1  103.29,32.93 90 top
C2  105.07,32.93 90 top
C3  40.64,27.1 270 top
C4  33.91,44.83 0 top
C5  34.04,34.17 270 top
C6  50.55,13.08 0 top
C7  52.08,19.05 90 top
C8  43.1,26.93 270 top
C9  17.28,43.17 90 top
C10  40.39,38.35 270 top
C11  43.05,38.6 270 top
C12  7.75,14.22 180 top
C13  34.16,40.25 90 top
CAST_BTN  12.7,35.55 270 top
G1  86.36,54.18 0 top
IC1  80.35,45.12 90 top
IC2  29.97,40 180 top
IC4  39.13,13.98 90 top
J1  67.19,-3.05 0 top
LCD  12.7,48.25 270 top
LED1  106.61,17.86 180 top
LED2  40.98,19.89 270 top
LED3  41.06,21.34 270 top
LED4  8.13,19.56 180 top
LED5  101.73,20.07 180 top
LED6  86.87,20.07 180 top
LED7  8.13,37.08 0 top
MOTOR  32.77,13.58 180 top
OLED  59.44,54.1 0 top
PMOD0  3.82,25.39 270 bottom
PMOD1  3.82,42.42 270 bottom
PWR  57.16,4.57 180 top
R1  72.64,45.46 270 top
R2  96.52,32.93 270 top
R3  69.99,45.47 270 top
R4  99.06,32.93 270 top
R5  93.98,32.93 270 top
R6  21.59,10.15 180 top
R7  91.44,32.93 270 top
R8  19.56,56.13 0 top
R9  35.31,26.29 180 top
R10  50.55,44.58 0 top
R11  50.55,42.34 180 top
R12  15.41,10.07 90 top
R13  9.82,10.03 90 top
R14  41.28,31.5 0 top
R15  34.92,31.24 90 top
R16  32.26,34.16 270 top
R17  33.95,46.66 0 top
R18  42.67,11.94 270 top
R19  21.59,15.23 0 top
R20  25.4,10.15 180 top
R21  25.4,15.23 180 top
R22  17.27,39.63 90 top
R23  7.75,12.57 0 top
R24  30.23,34.16 270 top
R25  29.93,46.98 90 top
R26  106.61,14.3 270 top
R27  101.17,32.93 90 top
R28  88.83,32.93 90 top
R29  50.63,30.65 0 top
R30  50.64,32.85 180 top
R31  44.43,19.96 0 top
R32  44.43,22 0 top
R33  27.87,46.98 90 top
R34  28.16,34.13 270 top
R35  88.91,20.07 270 top
R36  103.38,20.07 270 top
R37  7.75,16 0 top
R38  8.13,33.78 270 top
S1  81.63,8.38 0 top
S2  96.79,8.38 0 top
S3  96.65,22.1 0 top
S4  81.79,22.1 0 top
SCANNER  21.59,27.93 270 top
SENSE0  21.59,38.09 270 top
SENSE1  21.59,48.25 270 top
SPOIL_BTN  12.7,22.85 270 top
T3  12.62,10.15 90 top
T4  37.72,31.49 90 top
T5  21.59,12.69 180 top
T6  25.4,12.69 180 top
U1  91.77,35.81 90 top
U2  50.56,37.59 270 top
U3  50.59,26 270 top
U$1  27.86,23.45 0 top
U$2  68.58,55.87 180 top
Y1  88.22,45.12 270 top

### Tracks (layer width: path | path; a pad name or v marks a point on that pad's centre or on a via)
+1.8V  (via drill 0.35)
  Top 0.254: T6.3 24.55,11.54 R20.2 23.54,9.14 21.75,9.14 R6.2 20.74,11.54 T5.3 | U2.4 53.35,37.9 53.35,43.94 52.7,44.58 R10.2
  Top 0.406: U2.2 43.54,37.59 C11.2 40.76,37.1 C10.2 39.63,36.72 v39.63,36.07 | T6.3 24.68,11.68 26.12,13.12 26.12,13.16 27.06,14.1 27.69,14.1 28.58,14.99 28.58,21.34 v29.09,21.84
  Top 0.66: U2.4 U2.2
  Route15 0.406: v29.09,21.84 33.03,21.84 39.38,28.19 39.38,35.81 v39.63,36.07
+3V3  (via drill 0.35)
  Top 0.254: 102.11,32.08 101.35,32.08 R27.1 100.34,32.92 v100.34,35.56 | 102.11,32.08 103.26,32.08 C1.1 C2.1 | U1.4 103.58,41.51 103.89,41.19 103.89,36.58 v102.88,35.56 102.11,34.8 102.11,32.08 | R28.1 R7.2 90.18,33.34 v90.18,35.56 | R4.2 97.8,33.34 v97.8,35.56 | R2.2 95.26,33.34 v95.26,35.56 | R5.2 92.97,33.09 v92.97,35.56 | 70.11,44.61 70,44.61 R3.2 | 99.32,15.13 S2.A | 84.19,15.13 S1.A | 99.32,15.13 | R19.2 R21.2 23.63,16.16 v23.63,16.51 | LED1.A 104.98,18.61 104.78,18.41 | 100.84,14.73 101.1,14.73 104.78,18.41 | R35.2 88.91,15.13 | R36.2 104.06,18.41 104.78,18.41 | 32.8,38.33 33.31,38.33 35.19,36.45 35.19,34.67 34.76,34.24 33.19,34.24 R16.2 | 33.02,52.06 29.93,48.97 R25.2 | 33.02,52.06 U$2.3V | R17.2 36.71,48.56 36.71,49.78 34.43,52.06 33.02,52.06
  Top 0.406: S2.4 101.35,7.57 101.35,14.22 100.84,14.73 100.44,15.13 99.32,15.13 93.48,15.13 | S1.4 85.1,8.67 85.1,14.22 84.19,15.13 | S1.A 88.91,15.13 93.48,15.13 | 93.48,15.13 93.48,19.3 95,20.83 99.99,20.83 101.35,22.19 101.35,32.08 | SENSE0.3 22.31,32.42 29.34,32.42 R24.2 R16.2 | IC2.8 32.8,38.33 33.86,39.38 C13.1
  Top 0.66: U2.3 47.97,34.77 62.46,34.77 70.11,42.42 70.11,44.61 | R3.2 72.63,44.62 R1.2 74.04,43.22 IC1.8 78.69,42.16 v80.27,42.16 | CAST_BTN.4 15.75,24.75 15.75,22.1 13.97,20.32 SPOIL_BTN.2
  Bottom 0.406: v23.63,16.51 23.37,16.76 | 14.99,17.27 14.61,17.27 | SPOIL_BTN.2 12.82,20.07 | 58.17,54.36 OLED.2 | CAST_BTN.4 11.95,27.94 | 12.45,33.02 CAST_BTN.2 | 26.93,48.39 26.93,48.51
  Bottom 0.66: v102.88,35.56 v100.34,35.56 v97.8,35.56 v95.26,35.56 v92.97,35.56 v90.18,35.56 84.08,35.56 80.27,39.37 v80.27,42.16 80.27,49.02 73.42,55.87 U$1.+3V3 67.53,51.56 60.71,51.56 OLED.2 | 14.61,17.27 SPOIL_BTN.4 | 12.82,20.07 14.48,20.07 14.99,19.56 14.99,17.27 22.87,17.27 v23.63,16.51 | PMOD0.11 6.35,20.32 SPOIL_BTN.2 | 23.37,16.76 77.72,16.76 79.35,15.13 S1.A | 58.17,54.36 56.9,55.63 35.31,55.63 U$2.3V 33.02,52.06 31.25,50.29 28.71,50.29 26.93,48.51 | SENSE0.3 CAST_BTN.2 10.17,33.02 7.11,36.07 PMOD1.11 7.63,38.61 7.63,42.42 10.92,45.72 LCD.2 18.3,45.72 20.84,43.18 SENSE1.3 26.93,48.39 | 11.95,27.94 10.93,28.96 10.93,31.5 12.45,33.02
+5V
  Top 0.254: R29.2 54.11,28.02 54.11,26.42 U3.4
  Top 0.66: U3.4 U3.2 46.99,25.49 43.16,25.49 | SCANNER.4 23.37,20.32 26.42,23.37 35.97,23.37 38.1,25.49 41.15,25.49 | 43.16,25.49 41.15,25.49 | C3.2 41.15,25.71 41.15,25.49 | C8.2 43.16,25.49
+12V
  Top 0.152: J1.PWR 66.95,10.65 66.68,10.92
  Top 0.61: C7.1 51.81,17.79 47.25,17.84 41.03,17.9 IC4.5
  Top 0.66: U3.3 47.49,18.08 47.25,17.84
  Top 0.813: PWR.1 57.28,11.3 56.9,10.92 | 56.9,10.92 56.52,10.54 55.48,10.54 C6.+ 52.07,13.95 C7.1 | 66.68,10.92 56.9,10.92
GND  (via drill 0.3, 0.35)
  Top 0.254: U1.6 100.53,39.31 v100.34,39.12
  other vias: 28.45,11.68 30.99,11.68 34.8,11.68 37.98,12.83 39.12,12.83 40.27,12.83 37.98,13.84 37.98,14.86 39.12,14.86 39.12,13.84 40.27,14.86 40.27,13.84 53.85,10.41 55.12,9.14 58.93,9.14 61.47,9.14 48.77,19.3 50.04,19.3 29.72,18.03 30.99,19.3
  pour Bottom: 121.16,60.19 0,60.19 0,1.26 1.27,-0.01 121.16,-0.01
  pour Top: 118.02,-1.28 118.02,60.95 5.08,60.95 -1.27,54.6 -1.27,1.26 1.27,-1.28
  pour Route2: 122.43,-0.01 122.43,60.19 119.97,62.65 2.03,62.65 -1.78,58.84 -1.78,0.5 -1.27,-0.01
  pour Route15: 132.33,-2.55 132.33,64.26 5.84,64.26 -2.54,55.87 -2.54,2.53 2.54,-2.55
GPIO1.0
  Top 0.254: 12.71,22.86 11.95,22.86 10.17,24.64 10.17,27.11 5.53,31.75 PMOD0.1 | 12.71,22.86 SPOIL_BTN.1 | 12.71,22.86 10.14,20.29 10.14,15.59 9.54,14.98 9.39,14.98 C12.1 8.63,12.59 R23.2
  Route15 0.254: SPOIL_BTN.1 12.06,22.86 11.05,21.84 11.05,13 11.07,12.97 11.07,11.78 U$2.D5 20.7,2.16 75.95,2.16 81.82,8.03 85.03,8.03 S1.2
GPIO1.1  (via drill 0.35)
  Top 0.254: R13.2 10.09,11.14 T3.3 10.42,12.32 10.42,12.7 v10.16,12.7
  Route15 0.254: U$2.D4 15.24,6.34 10.16,11.43 v10.16,12.7 10.16,13.96 7.37,16.75 7.37,26.92 PMOD0.3
GPIO1.2
  Top 0.254: PMOD0.5 3.82,27.94 3.82,33.02 4.32,33.53 5.72,33.53 7.63,31.62 9.79,31.62 10.67,32.51 10.67,34.54 11.69,35.55 CAST_BTN.1 14.99,37.72 14.99,39.88 15.6,40.48 R22.2 C9.1
  Route15 0.254: PMOD0.5 5.08,26.64 6.43,24.85 6.43,14.42 9.2,11.65 9.2,11.11 12.7,7.62 U$2.D3 16.25,1.52 75.89,1.52 81.99,7.62 99.78,7.62 S2.2
GPIO1.3  (via drill 0.35)
  Top 0.254: v32.26,29.97 32.26,30.99 33.53,32.26 34.75,32.26 R15.2 36.31,32.09 T4.3
  Route15 0.254: PMOD0.7 3.82,22.86 3.82,16.46 8.79,11.48 8.79,10.26 10.16,8.9 U$2.D2
  Bottom 0.254: PMOD0.7 16.26,24.12 19.56,27.43 19.56,28.96 20.58,29.97 v32.26,29.97
GPIO2.0  (via drill 0.35)
  Top 0.254: U$2.D7 24.9,7.11 34.8,7.11 38.49,10.8 IC4.2
  Route15 0.254: PMOD0.6 2.55,26.16 1.28,24.89 1.28,18.42 8.39,11.31 8.39,8.64 v8.64,8.38 | v19.06,7.62 20.31,7.62 U$2.D7
  Bottom 0.254: v8.64,8.38 18.29,8.38 v19.06,7.62
GPIO2.1  (via drill 0.35)
  Top 0.254: IC4.3 39.63,11.13 39.63,9.91 37.6,7.87 v37.34,7.87
  Bottom 0.254: v37.34,7.87 36.33,6.86 21.09,6.86 20.32,6.09 U$2.D6 18.03,7.37 7.88,7.37 7.31,7.94 7.31,11.07 3.82,14.57 3.82,22.86 PMOD0.8
GPIOX.0  (via drill 0.35)
  Top 0.254: IC2.1 31.88,45.85 v31.76,45.97 32.44,46.66 R17.1 33.1,44.63 33.28,44.45 33.28,44.58 C4.1 34.68,43.18 v34.8,43.18 | S3.C1 96.65,17.91 98.06,19.32 LED5.C | S3.C0 92.84,25.91 82.81,25.91 v74.56,34.16
  Route15 0.254: U$2.A3 11.52,54.69 19.05,54.69 25.95,47.79 29.94,47.79 v31.76,45.97
  Bottom 0.254: PMOD1.5 6.36,44.96 6.36,49.53 U$2.A3 | S3.C0 S3.C1 | v34.8,43.18 37.09,40.89 37.09,39.12 38.36,37.85 70.87,37.85 v74.56,34.16
GPIOX.1  (via drill 0.35)
  Top 0.254: LED6.C 83.51,19.32 S4.C1 S4.C0 81.79,25.4 v74.17,33.02 | R16.1 32.09,35.17 31.59,35.17 | 31.59,35.17 31.71,35.05 C5.1 34.04,35.56 v33.03,36.58 | 31.59,35.17 30.61,36.15 30.61,36.83 IC2.7 30.61,39.5 29.72,40.39 20.07,40.39 18.29,42.16 18.29,47.74 U$2.A2
  Bottom 0.254: PMOD1.7 7.37,43.44 7.37,49.53 9.15,51.31 11.18,51.31 12.7,52.83 U$2.A2 | v33.03,36.58 37.34,36.58 38.11,37.34 69.86,37.34 v74.17,33.02
MISO  (via drill 0.35)
  Top 0.254: U1.7 102.27,38.35 100.84,38.35 99.06,36.56 R4.1 99.93,32.91 99.93,32.75 99.96,32.73 v99.96,30.73 | PMOD1.6 2.8,43.69 4.07,42.42 6.36,42.42 v8.9,39.88
  Route15 0.254: v99.96,30.73 99.96,29.59 97.29,26.92 62.49,26.92 47.31,11.74 47.31,5.08 45.53,3.3 38.86,3.3 U$2.D12 35.05,7.11 27.94,7.11 16.87,18.18 16.87,24.42 15.4,25.88 10.82,25.88 9.4,27.29 9.4,27.76 8.23,28.94 8.23,39.21 v8.9,39.88
MOSI  (via drill 0.35)
  Top 0.254: U1.3 100.59,42.61 93.98,35.99 R5.1 95.13,32.63 v95.13,30.61 | v39.38,8.38 38.94,8.38 37.01,6.45 35.92,6.45 U$2.D11
  Route15 0.254: U$2.D11 33.15,6.47 30.1,6.47 30.06,6.51 27.96,6.51 16.46,18.01 16.46,24.25 15.24,25.47 10.6,25.47 9,27.07 9,27.59 7.7,28.89 7.7,48.7 5.34,51.05 2.04,51.05 1.28,50.29 1.28,47.5 PMOD1.4 | v39.38,8.38 41.66,8.38 61.73,28.45 93.99,28.45 95.13,29.59 v95.13,30.61
MOTOR1
  Top 0.254: 35.82,18.54 35.82,21.84 36.33,22.35 39.3,22.35 LED3.A
  Top 0.61: IC4.6 39.76,18.29 arc-90 39.51,18.54 35.82,18.54 31.5,18.54 30.23,17.27 30.23,12.95 arc-90 30.1,13.09 MOTOR.2
MOTOR2  (via drill 0.35)
  Top 0.254: v36.84,21.34 37.34,20.83 37.34,19.9 LED2.A
  Top 0.61: MOTOR.1 32.89,15.75 arc-90 34.54,17.4 37.22,17.4 IC4.8
  Route15 0.254: MOTOR.1 36.58,17.27 36.58,21.08 v36.84,21.34
N$1
  Top 0.254: R24.1 29.72,35.01 | 29.72,35.01 28.07,36.66 IC2.5 | R34.1 28.19,35.01 29.72,35.01
N$2
  Top 0.254: IC2.3 29.34,45.54 R25.1 R33.1
N$3
  Top 0.254: IC1.1 87.59,43.22 Y1.2
N$4
  Top 0.254: R26.1 LED1.C
N$6
  Top 0.254: U1.8 101.17,35.87 R27.2
N$7
  Top 0.254: U1.1 99.42,44.81 94.75,40.13 91.7,40.13 88.83,37.26 R28.2
N$8
  Top 0.254: IC1.2 85.64,44.49 87.55,46.4 Y1.1
N$9
  Top 0.254: IC1.3 84.88,45.76 85.6,46.48 85.6,50.29 | 85.6,50.29 84.84,51.05 82.81,51.05 79.76,54.11 G1.+@1 | 85.6,50.29 90.18,50.29 92.97,53.09 92.97,55.12 92.96,55.11 G1.+@2
N$10
  Top 0.254: T3.1 14.45,10.18 R12.1
N$11
  Top 0.254: R29.1 49.78,30.73 | 49.78,30.73 49.78,32.84 R30.2 | U3.1 47.49,28.45 49.78,30.73
N$12
  Top 0.254: 47.46,40.1 R11.2 R10.1
  Top 0.33: U2.1 47.46,40.1
N$13
  Top 0.152: SENSE1.2 19.56,47.61 19.56,53.59 20.83,54.86 20.83,55.71 R8.2
  Top 0.254: IC2.2 30.86,42.85 30.86,46.74 30.61,46.99 22.74,46.99 SENSE1.2
N$14  (via drill 0.35)
  Top 0.254: S1.C 81.14,1.63 79.25,3.51 79.25,9.91 57.92,31.24 v57.87,31.19 | R12.2 15.41,16.6 14.24,17.78 12.96,17.78 | 12.96,17.78 SPOIL_BTN.3 | v17.53,27.69 17.53,22.35 12.96,17.78
  Bottom 0.254: v17.53,27.69 17.28,27.94 17.28,28.7 19.41,30.84 56.05,30.84 56.41,31.19 v57.87,31.19
N$15
  Top 0.254: IC2.6 29.34,39.25 29.22,39.37 26.68,39.37 26.68,36.83 25.91,36.07 21.98,36.07 SENSE0.2 19.56,33.66 19.56,32 20.83,30.73 29.72,30.73 34.17,26.29 R9.2
N$16
  Top 0.254: LED2.C 41.81,19.98 R31.1
N$17
  Top 0.254: LED3.C 42.49,22.01 R32.1
N$18
  Top 0.254: LED6.A 87.38,20.82 87.61,21.04 R35.1
N$19
  Top 0.254: LED5.A 103.36,20.82 R36.1
N$20
  Top 0.152: PMOD0.12 3.81,17.78 6.36,17.78 6.86,18.29 6.86,19.56 7.61,20.31 LED4.A
N$21
  Top 0.152: R37.1 6.9,17.58 LED4.C
N$22
  Top 0.254: R38.1 9.15,35.65 9.15,37.08 8.4,37.83 LED7.C
N$23
  Top 0.254: PMOD1.12 3.82,34.8 6.1,34.8 6.61,35.31 6.61,36.07 6.88,36.33 LED7.A
N$26
  Top 0.254: T4.1 40.41,31.52 R14.1
N$29
  Top 0.254: IC4.4 42.5,11.26 R18.2
N$30  (via drill 0.35)
  Top 0.254: S2.C 96.65,1.78 87.76,1.78 83.71,5.83 83.33,5.83 80.04,9.12 80.04,9.95 58.59,31.4 58.59,32.16 v58.68,32.26 58.68,32.51 57.41,33.78 49.03,33.78 46.75,31.5 R14.2
  Bottom 0.254: v58.68,32.26 56.9,32.26 55.89,31.24 18.29,31.24 18.04,31.5 13.85,31.5 CAST_BTN.3
N$39  (via drill 0.3)
  other vias: 72.9,11.68
N$40  (via drill 0.3)
  other vias: 70.36,11.68
N$41  (via drill 0.3)
  other vias: 64.01,9.14
SCAN_DIN
  Top 0.254: T6.1 25.39,13.73 | 25.39,13.73 26.25,14.59 R21.1 26.25,15.41 23.37,18.29 20.83,18.29 20.07,19.05 20.07,21.21 SCANNER.3 | U$2.D1 10.42,7.87 17.28,7.87 18.29,8.89 18.29,12.45 18.8,12.95 24.62,12.95 25.39,13.73
SCAN_DOUT
  Top 0.254: U$2.D0 7.12,7.11 9.08,7.11 10.25,8.28 17.11,8.28 17.79,8.96 17.79,12.7 18.8,13.71 T5.1 | T5.1 20.74,14.54 R19.1 | T5.1 21.56,16.54 19.56,18.54 19.56,25.15 19.81,25.39 SCANNER.2
SCK  (via drill 0.35)
  Top 0.254: U1.5 100.36,40.41 96.52,36.56 R2.1 97.8,32.5 v97.8,30.48 | v9.4,38.86 9.05,39.22 8.62,39.22 7.97,39.88 3.82,39.88 PMOD1.8
  Route15 0.254: v97.8,30.48 97.8,28.7 96.78,27.69 62.23,27.69 U$2.D13 37.48,7.22 37.07,7.22 36.67,7.62 28.07,7.62 17.27,18.41 17.27,24.59 15.57,26.28 11.18,26.28 9.81,27.66 9.81,27.93 8.64,29.1 8.64,38.1 v9.4,38.86
SCL0
  Top 0.254: IC1.6 77.38,45.5 71.34,45.5 70.49,46.36 69.98,46.36 | 69.98,46.36 68.85,47.49 68.85,56.94 U$1.CLK 67.02,56.13 62.74,56.13 OLED.3 | U$2.A5 7.88,50.53 7.88,41.47 8.71,40.64 13.21,40.64 13.21,40.63 LCD.4 | R3.1 69.98,46.36
  Route15 0.254: LCD.4 52.07,40.63 68.34,56.9 U$1.CLK
  Bottom 0.254: PMOD1.3 3.82,47.5 3.82,52.07 U$2.A5
SDA0
  Top 0.254: U$1.DAT 70.88,51.3 75.19,46.99 | 75.19,46.99 77.6,46.99 IC1.5 | R1.1 73.32,46.99 75.19,46.99 | LCD.3 10.79,43.18 8.29,45.68 8.29,50.7 7.62,51.37 U$2.A4
  Route15 0.254: OLED.4 63.25,52.83 51.82,41.4 20.58,41.4 18.81,43.18 LCD.3
  Bottom 0.254: OLED.4 64.01,54.86 69.09,54.86 70.88,56.65 U$1.DAT | PMOD1.1 5.09,50.8 U$2.A4
SS  (via drill 0.35)
  Top 0.254: U1.2 100.1,43.71 93.19,36.8 93.19,36.79 93.03,36.63 93.02,36.63 91.44,35.04 R7.1 92.72,32.5 v92.72,30.48 | U$2.D10 33.27,6.34 34.8,6.34 37.6,9.14 37.85,9.14 v38.11,9.4
  Route15 0.254: U$2.D10 31.01,6.07 29.93,6.07 29.89,6.11 27.79,6.11 16.05,17.84 16.05,24.08 15.07,25.06 10.18,25.06 8.59,26.65 8.59,27.42 7.16,28.85 7.16,46.69 6.36,47.5 3.82,47.5 PMOD1.2 | v38.11,9.4 41.15,9.4 60.97,29.21 91.95,29.21 92.72,29.97 v92.72,30.48
UART1_RX  (via drill 0.35)
  Top 0.254: v24.39,8.38 25.41,8.38 26.25,9.22 R20.1 26.25,11.59 T6.2
  Route15 0.254: PMOD0.4 3.81,30.48 5.68,30.48 6.22,29.93 6.22,28.64 7.78,27.09 7.78,26.12 9.65,24.25 14.73,24.25 15.24,23.74 15.24,15.36 18.55,12.05 18.55,9.65 19.82,8.38 v24.39,8.38
UART1_TX  (via drill 0.35)
  Top 0.254: R6.1 22.44,11.59 T5.2 22.53,11.77 21.85,12.45 19.82,12.45 v19.3,11.93
  Route15 0.254: PMOD0.2 3.68,32.89 5.97,32.89 6.63,32.23 6.63,28.81 8.19,27.26 8.19,26.48 10.01,24.66 14.9,24.66 15.65,23.91 15.65,15.59 v19.3,11.93
(copper drawn outside any net)
  shapes: Top area x2

### Text on the board
tPlace: + | -
tNames: CR927 | GND | 3V3 | SCL | SDA | 1v8 | 5v | PAPER | IN | FEED | OUT | SENSE0 | SENSE1 | POWER | BVS2019 R4 | +12V | SPOIL | CAST
bNames: Warning: Do not connect Arduino and / PMOD connectors at the same time